# Altium schematic sheet top_sheet.SchDoc
size A4
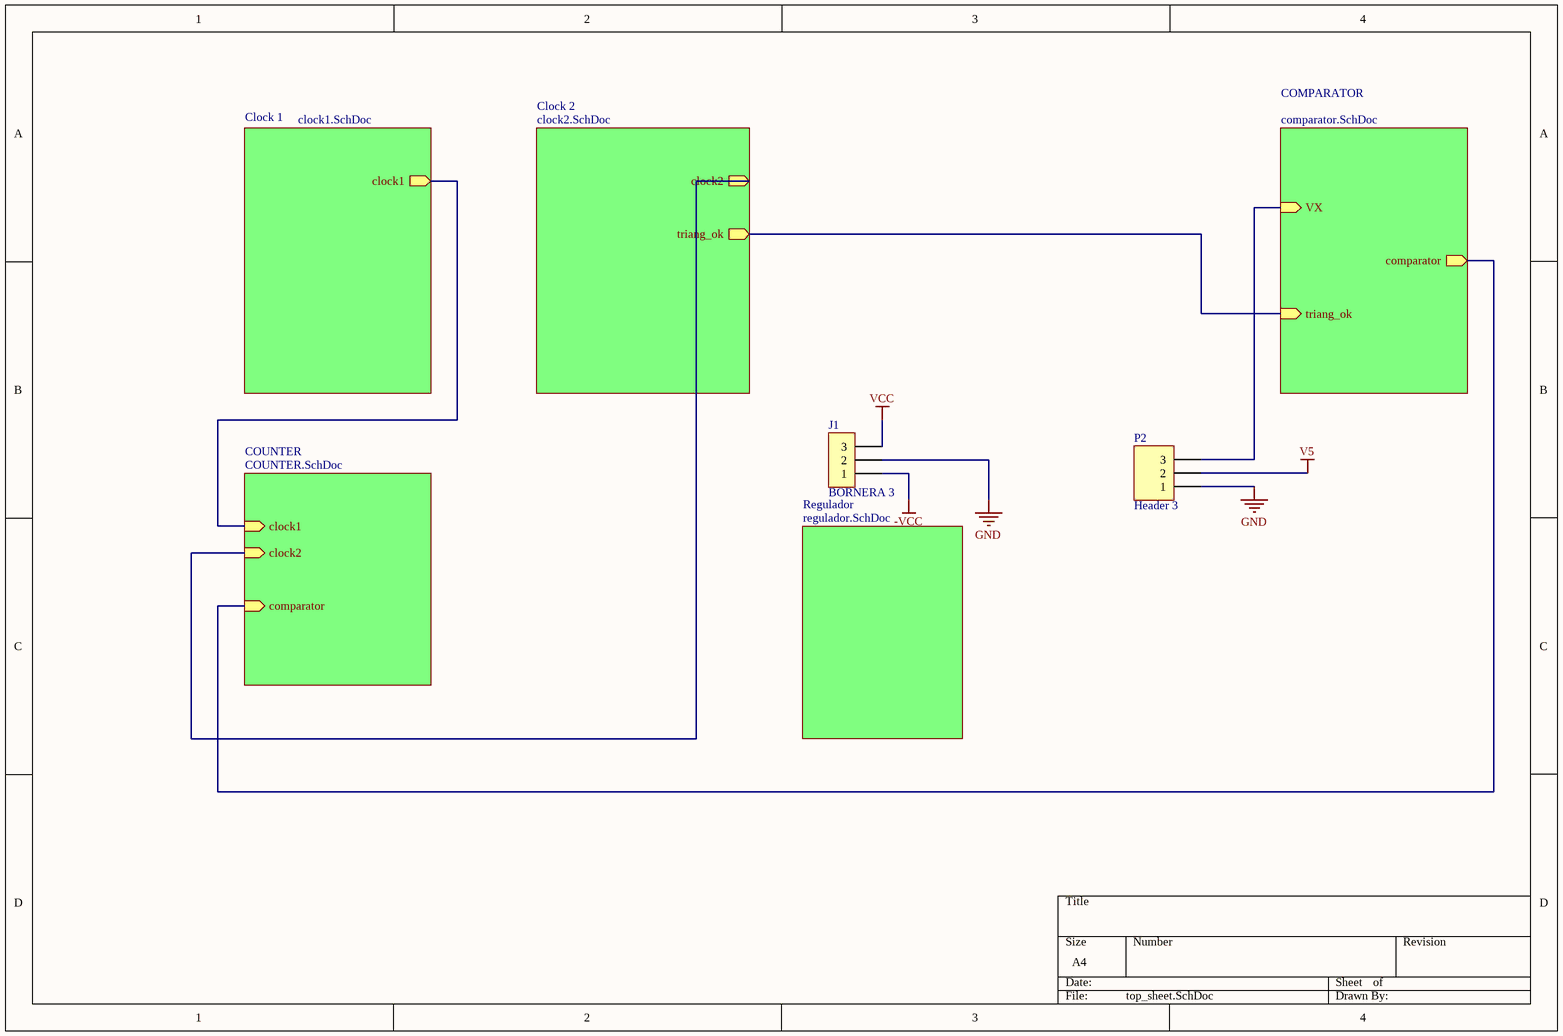
[diagram p0: top_sheet.SchDoc]

## Parts
J1  BORNERA 3  [BORNERA3]
P2  Header 3  [HDR1X3]

## Sub-sheets
Clock 1 = clock1.SchDoc: clock1 (out)
Clock 2 = clock2.SchDoc: clock2 (out), triang_ok (out)
COMPARATOR = comparator.SchDoc: VX (in), triang_ok (in), comparator (out)
COUNTER = COUNTER.SchDoc: clock1 (in), clock2 (in), comparator (in)
Regulador = regulador.SchDoc: no entries

## Nets
-VCC: J1.1
GND: J1.2 P2.1
V5: P2.2
VCC: J1.3
NetP2_3: P2.3 ; sheet COMPARATOR/VX
(unnamed): sheet Clock 1/clock1, sheet COUNTER/clock1
(unnamed): sheet Clock 2/clock2, sheet COUNTER/clock2
(unnamed): sheet Clock 2/triang_ok, sheet COMPARATOR/triang_ok
(unnamed): sheet COUNTER/comparator, sheet COMPARATOR/comparator

## Library data of the parts
P2 = Header 3: Header, 3-Pin; LatestRevisionDate: 17-Jul-2002; LatestRevisionNote: Re-released for DXP Platform.; Publisher: Altium Limited